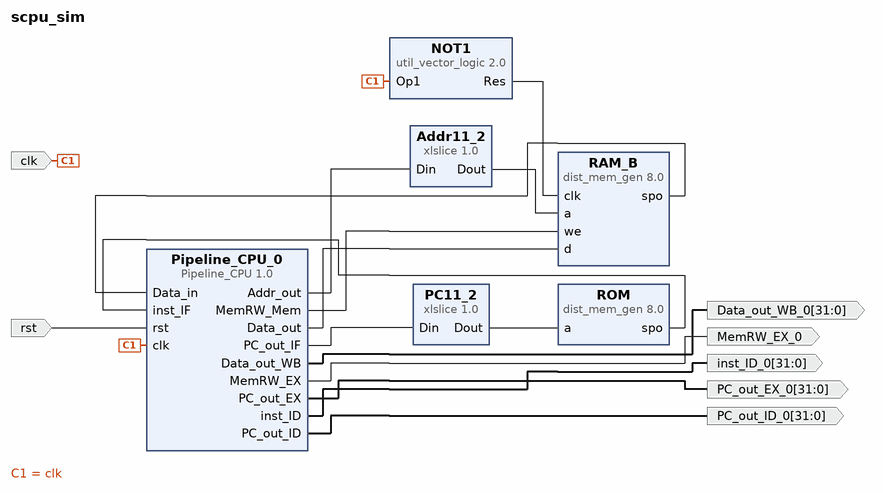
[diagram p0: block diagram of the top level]
# Vivado block design scpu_sim, xc7k160tffg676-2L, Vivado 2020.2
create_bd_design scpu_sim

create_bd_port -dir I -type clk clk
create_bd_port -dir I -type rst rst
create_bd_port -dir O -from 31 -to 0 Data_out_WB_0
create_bd_port -dir O MemRW_EX_0
create_bd_port -dir O -from 31 -to 0 PC_out_EX_0
create_bd_port -dir O -from 31 -to 0 PC_out_ID_0
create_bd_port -dir O -from 31 -to 0 inst_ID_0

create_bd_cell -type ip -vlnv xilinx.com:ip:dist_mem_gen:8.0 ROM
set_property -dict [list \
  CONFIG.coefficient_file ../../../../../../coe/h.coe \
  CONFIG.data_width 32 \
  CONFIG.depth 1024 \
  CONFIG.memory_type rom \
] [get_bd_cells ROM]
create_bd_cell -type ip -vlnv xilinx.com:ip:dist_mem_gen:8.0 RAM_B
set_property -dict [list \
  CONFIG.coefficient_file ../../../../../../coe/D_mem.coe \
  CONFIG.data_width 32 \
  CONFIG.depth 1024 \
] [get_bd_cells RAM_B]
create_bd_cell -type ip -vlnv xilinx.com:ip:util_vector_logic:2.0 NOT1
set_property -dict {CONFIG.C_OPERATION not CONFIG.C_SIZE 1} [get_bd_cells NOT1]
create_bd_cell -type ip -vlnv xilinx.com:ip:xlslice:1.0 Addr11_2
set_property -dict {CONFIG.DIN_FROM 11 CONFIG.DIN_TO 2 CONFIG.DOUT_WIDTH 10} [get_bd_cells Addr11_2]
create_bd_cell -type ip -vlnv xilinx.com:ip:xlslice:1.0 PC11_2
set_property -dict {CONFIG.DIN_FROM 11 CONFIG.DIN_TO 2 CONFIG.DOUT_WIDTH 10} [get_bd_cells PC11_2]
create_bd_cell -type ip -vlnv xilinx.com:user:Pipeline_CPU:1.0 Pipeline_CPU_0

# ---- connections ----

connect_bd_net -net clk_0_1 [get_bd_ports clk] [get_bd_pins NOT1/Op1] [get_bd_pins Pipeline_CPU_0/clk]
connect_bd_net -net rst_0_1 [get_bd_ports rst] [get_bd_pins Pipeline_CPU_0/rst]
connect_bd_net [get_bd_pins NOT1/Res] [get_bd_pins RAM_B/clk]
connect_bd_net [get_bd_pins RAM_B/spo] [get_bd_pins Pipeline_CPU_0/Data_in]
connect_bd_net [get_bd_pins ROM/spo] [get_bd_pins Pipeline_CPU_0/inst_IF]
connect_bd_net [get_bd_pins PC11_2/Dout] [get_bd_pins ROM/a]
connect_bd_net [get_bd_pins Addr11_2/Dout] [get_bd_pins RAM_B/a]
connect_bd_net [get_bd_pins Pipeline_CPU_0/MemRW_Mem] [get_bd_pins RAM_B/we]
connect_bd_net [get_bd_pins Pipeline_CPU_0/Addr_out] [get_bd_pins Addr11_2/Din]
connect_bd_net [get_bd_pins Pipeline_CPU_0/Data_out] [get_bd_pins RAM_B/d]
connect_bd_net [get_bd_pins Pipeline_CPU_0/PC_out_IF] [get_bd_pins PC11_2/Din]
connect_bd_net [get_bd_pins Pipeline_CPU_0/Data_out_WB] [get_bd_ports Data_out_WB_0]
connect_bd_net [get_bd_pins Pipeline_CPU_0/MemRW_EX] [get_bd_ports MemRW_EX_0]
connect_bd_net [get_bd_pins Pipeline_CPU_0/PC_out_EX] [get_bd_ports PC_out_EX_0]
connect_bd_net [get_bd_pins Pipeline_CPU_0/PC_out_ID] [get_bd_ports PC_out_ID_0]
connect_bd_net [get_bd_pins Pipeline_CPU_0/inst_ID] [get_bd_ports inst_ID_0]

validate_bd_design
save_bd_design
